# Altium schematic sheet Ethernet.SchDoc
size A4; PageSetup: Record=PageOptions|CenterHorizontal=True|CenterVertical=True|PrintScale=0.98|XCorrection=1.00|YCorrection=1.00|PrintKind=0|BorderSize=5000000|LeftOffset=0|BottomOffset=0|Orientation=2|PaperLength=1000|PaperWidth=1000|Scale=100|PaperSource=7|PrintQuality=-4|MediaType=1|DitherType=10|PaperKind=A4 210x297 ºÁÃ×|PrintScaleMode=1
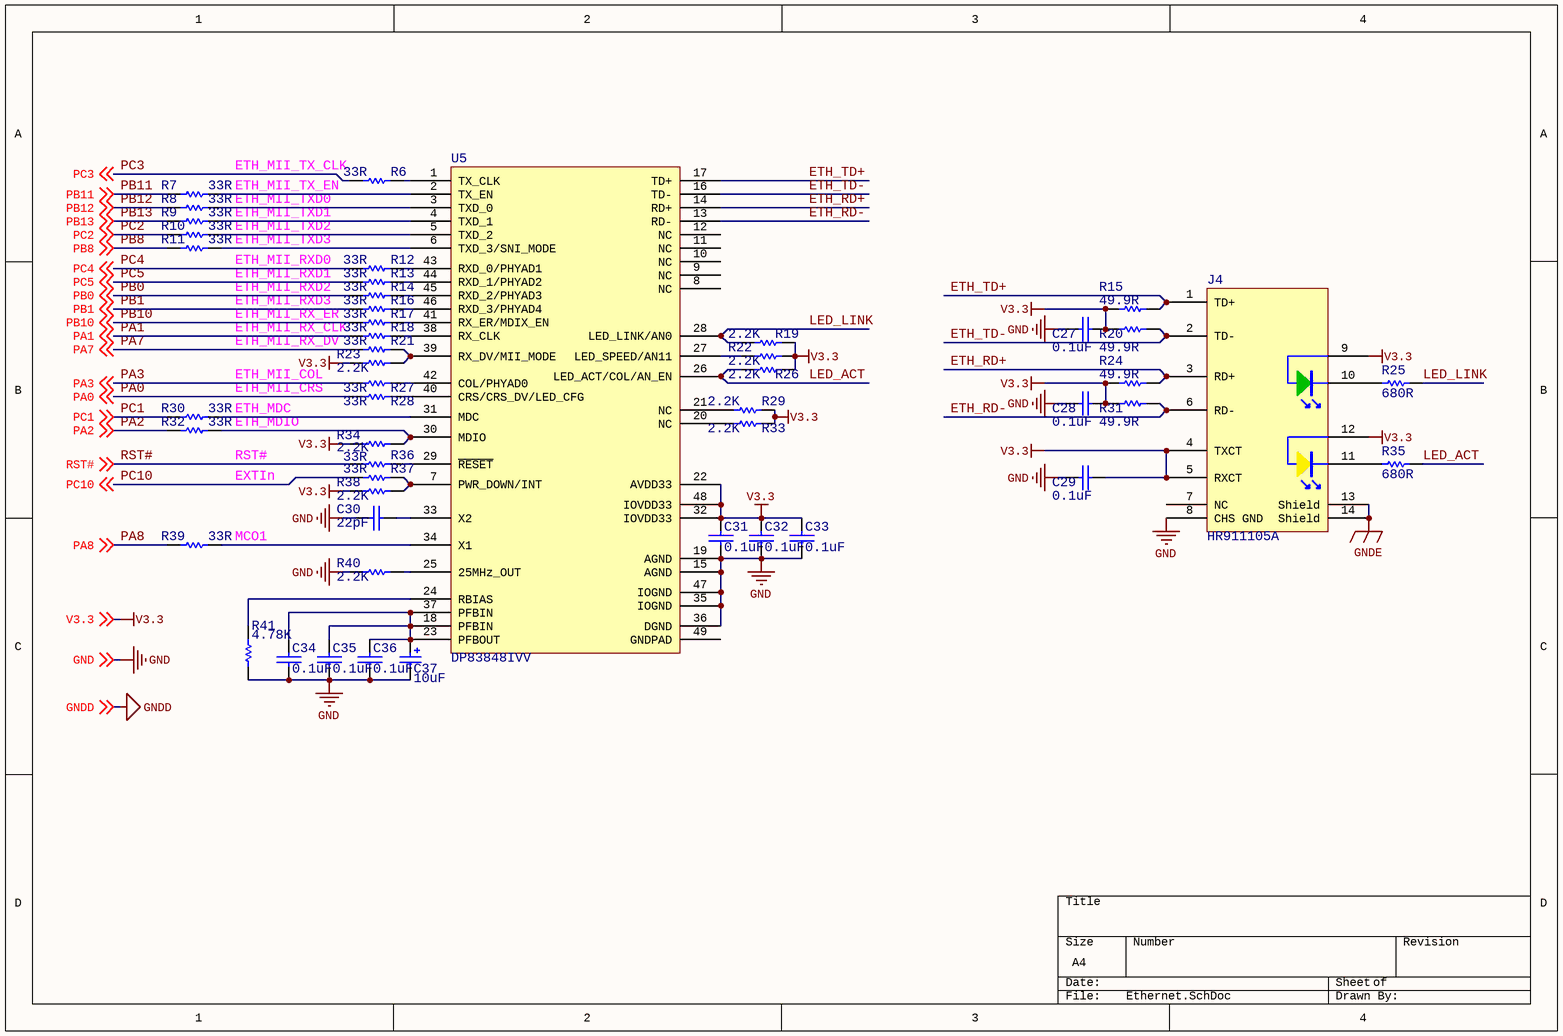
[diagram p0: Ethernet.SchDoc]

## Parts
C27  0.1uF  [C1608(0603)]
C28  0.1uF  [C1608(0603)]
C29  0.1uF  [C1608(0603)]
C30  22pF  [C1608(0603)]
C31  0.1uF  [C1608(0603)]
C32  0.1uF  [C1608(0603)]
C33  0.1uF  [C1608(0603)]
C34  0.1uF  [C1608(0603)]
C35  0.1uF  [C1608(0603)]
C36  0.1uF  [C1608(0603)]
C37  10uF  [C2012(0805)]
J4  HR911105A  [RJ45-LED]
R6  33R  [R1608(0603)]
R7  33R  [R1608(0603)]
R8  33R  [R1608(0603)]
R9  33R  [R1608(0603)]
R10  33R  [R1608(0603)]
R11  33R  [R1608(0603)]
R12  33R  [R1608(0603)]
R13  33R  [R1608(0603)]
R14  33R  [R1608(0603)]
R15  49.9R  [R1608(0603)]
R16  33R  [R1608(0603)]
R17  33R  [R1608(0603)]
R18  33R  [R1608(0603)]
R19  2.2K  [R1608(0603)]
R20  49.9R  [R1608(0603)]
R21  33R  [R1608(0603)]
R22  2.2K  [R1608(0603)]
R23  2.2K  [R1608(0603)]
R24  49.9R  [R1608(0603)]
R25  680R  [R1608(0603)]
R26  2.2K  [R1608(0603)]
R27  33R  [R1608(0603)]
R28  33R  [R1608(0603)]
R29  2.2K  [R1608(0603)]
R30  33R  [R1608(0603)]
R31  49.9R  [R1608(0603)]
R32  33R  [R1608(0603)]
R33  2.2K  [R1608(0603)]
R34  2.2K  [R1608(0603)]
R35  680R  [R1608(0603)]
R36  33R  [R1608(0603)]
R37  33R  [R1608(0603)]
R38  2.2K  [R1608(0603)]
R39  33R  [R1608(0603)]
R40  2.2K  [R1608(0603)]
R41  4.78K  [R1608(0603)]
U5  DP83848IVV  [LQFP48_M]

## Nets
GND: C27.2 C28.2 C29.2 C30.1 C31.1 C32.1 C33.1 C34.1 C35.1 C36.1 C37.2 J4.8(CHS_GND) R40.2 R41.2 U5.15(AGND) U5.19(AGND) U5.35(IOGND) U5.36(DGND) U5.47(IOGND) ; off-sheet GND
GNDE: J4.13(Shield) J4.14(Shield)
V3.3: C27.1 C28.1 C29.1 C31.2 C32.2 C33.2 J4.4(TXCT) J4.5(RXCT) J4.9 J4.12 R15.2 R19.1 R20.2 R22.1 R23.2 R24.2 R26.1 R29.1 R31.2 R33.1 R34.2 R38.2 U5.22(AVDD33) U5.32(IOVDD33) U5.48(IOVDD33) ; off-sheet V3.3
ETH_RD+: J4.3(RD+) R24.1 U5.14(RD+)
ETH_RD-: J4.6(RD-) R31.1 U5.13(RD-)
ETH_TD+: J4.1(TD+) R15.1 U5.17(TD+)
ETH_TD-: J4.2(TD-) R20.1 U5.16(TD-)
LED_ACT: R26.2 R35.2 U5.26(LED_ACT/COL/AN_EN)
LED_LINK: R19.2 R25.2 U5.28(LED_LINK/AN0)
PA0: R28.2 ; off-sheet PA0
PA1: R18.2 ; off-sheet PA1
PA2: R32.2 ; off-sheet PA2
PA3: R27.2 ; off-sheet PA3
PA7: R21.2 ; off-sheet PA7
PA8: R39.2 ; off-sheet PA8
PB0: R14.2 ; off-sheet PB0
PB1: R16.2 ; off-sheet PB1
PB8: R11.2 ; off-sheet PB8
PB10: R17.2 ; off-sheet PB10
PB11: R7.2 ; off-sheet PB11
PB12: R8.2 ; off-sheet PB12
PB13: R9.2 ; off-sheet PB13
PC1: R30.2 ; off-sheet PC1
PC2: R10.2 ; off-sheet PC2
PC3: R6.2 ; off-sheet PC3
PC4: R12.2 ; off-sheet PC4
PC5: R13.2 ; off-sheet PC5
PC10: R37.2 ; off-sheet PC10
RST#: R36.2 ; off-sheet RST#
NetC30_2: C30.2 U5.33(X2)
NetC34_2: C34.2 C35.2 C36.2 C37.1 U5.18(PFBIN) U5.23(PFBOUT) U5.37(PFBIN)
NetJ4_10: J4.10 R25.1
NetJ4_11: J4.11 R35.1
NetR6_1: R6.1 U5.1(TX_CLK)
NetR7_1: R7.1 U5.2(TX_EN)
NetR8_1: R8.1 U5.3(TXD_0)
NetR9_1: R9.1 U5.4(TXD_1)
NetR10_1: R10.1 U5.5(TXD_2)
NetR11_1: R11.1 U5.6(TXD_3/SNI_MODE)
NetR12_1: R12.1 U5.43(RXD_0/PHYAD1)
NetR13_1: R13.1 U5.44(RXD_1/PHYAD2)
NetR14_1: R14.1 U5.45(RXD_2/PHYAD3)
NetR16_1: R16.1 U5.46(RXD_3/PHYAD4)
NetR17_1: R17.1 U5.41(RX_ER/MDIX_EN)
NetR18_1: R18.1 U5.38(RX_CLK)
NetR21_1: R21.1 R23.1 U5.39(RX_DV/MII_MODE)
NetR22_2: R22.2 U5.27(LED_SPEED/AN11)
NetR27_1: R27.1 U5.42(COL/PHYAD0)
NetR28_1: R28.1 U5.40(CRS/CRS_DV/LED_CFG)
NetR29_2: R29.2 U5.21(NC)
NetR30_1: R30.1 U5.31(MDC)
NetR32_1: R32.1 R34.1 U5.30(MDIO)
NetR33_2: R33.2 U5.20(NC)
NetR36_1: R36.1 U5.29(~{RESET})
NetR37_1: R37.1 R38.1 U5.7(PWR_DOWN/INT)
NetR39_1: R39.1 U5.34(X1)
NetR40_1: R40.1 U5.25(25MHz_OUT)
NetR41_1: R41.1 U5.24(RBIAS)

Not connected (* = marked no-connect by the designer): J4 7(NC); U5 8(NC) 9(NC) 10(NC) 11(NC) 12(NC) 49(GNDPAD)

## Notes on the sheet
- ETH_MII_TX_CLK
- ETH_MII_TX_EN
- ETH_MII_TXD0
- ETH_MII_TXD1
- ETH_MII_TXD2
- ETH_MII_TXD3
- ETH_MII_RXD0
- ETH_MII_RXD1
- ETH_MII_RXD2
- ETH_MII_RXD3
- ETH_MII_RX_ER
- ETH_MII_RX_DV
- ETH_MII_RX_CLK
- ETH_MII_COL
- ETH_MII_CRS
- ETH_MDC
- ETH_MDIO
- RST#
- EXTIn
- (near R39) MCO1

## Library data of the parts
C27-C36 = CAP: Capacitor
C37 = Cap Pol2: Polarized Capacitor (Axial); Value: 100pF/100V; Published: 8-Jun-2000; LatestRevisionDate: 17-Jul-2002; LatestRevisionNote: Re-released for DXP Platform.; PackageReference: POLAR0.8; Publisher: Altium Limited
R6-R41 = Res Semi: Semiconductor Resistor; Value: 1K; Published: 8-Jun-2000; LatestRevisionDate: 17-Jul-2002; LatestRevisionNote: Re-released for DXP Platform.; PackageReference: AXIAL-0.5; Publisher: Altium Limited
U5 = DP83848CVV